# EasyEDA schematic A1-terminal.json
TITLE: APPLE-1 SERIAL TERMINAL; REV: 1.01; Date: 2023-01-21; Sheet: 1/1; Drawn By: CP; Company: P-LAB
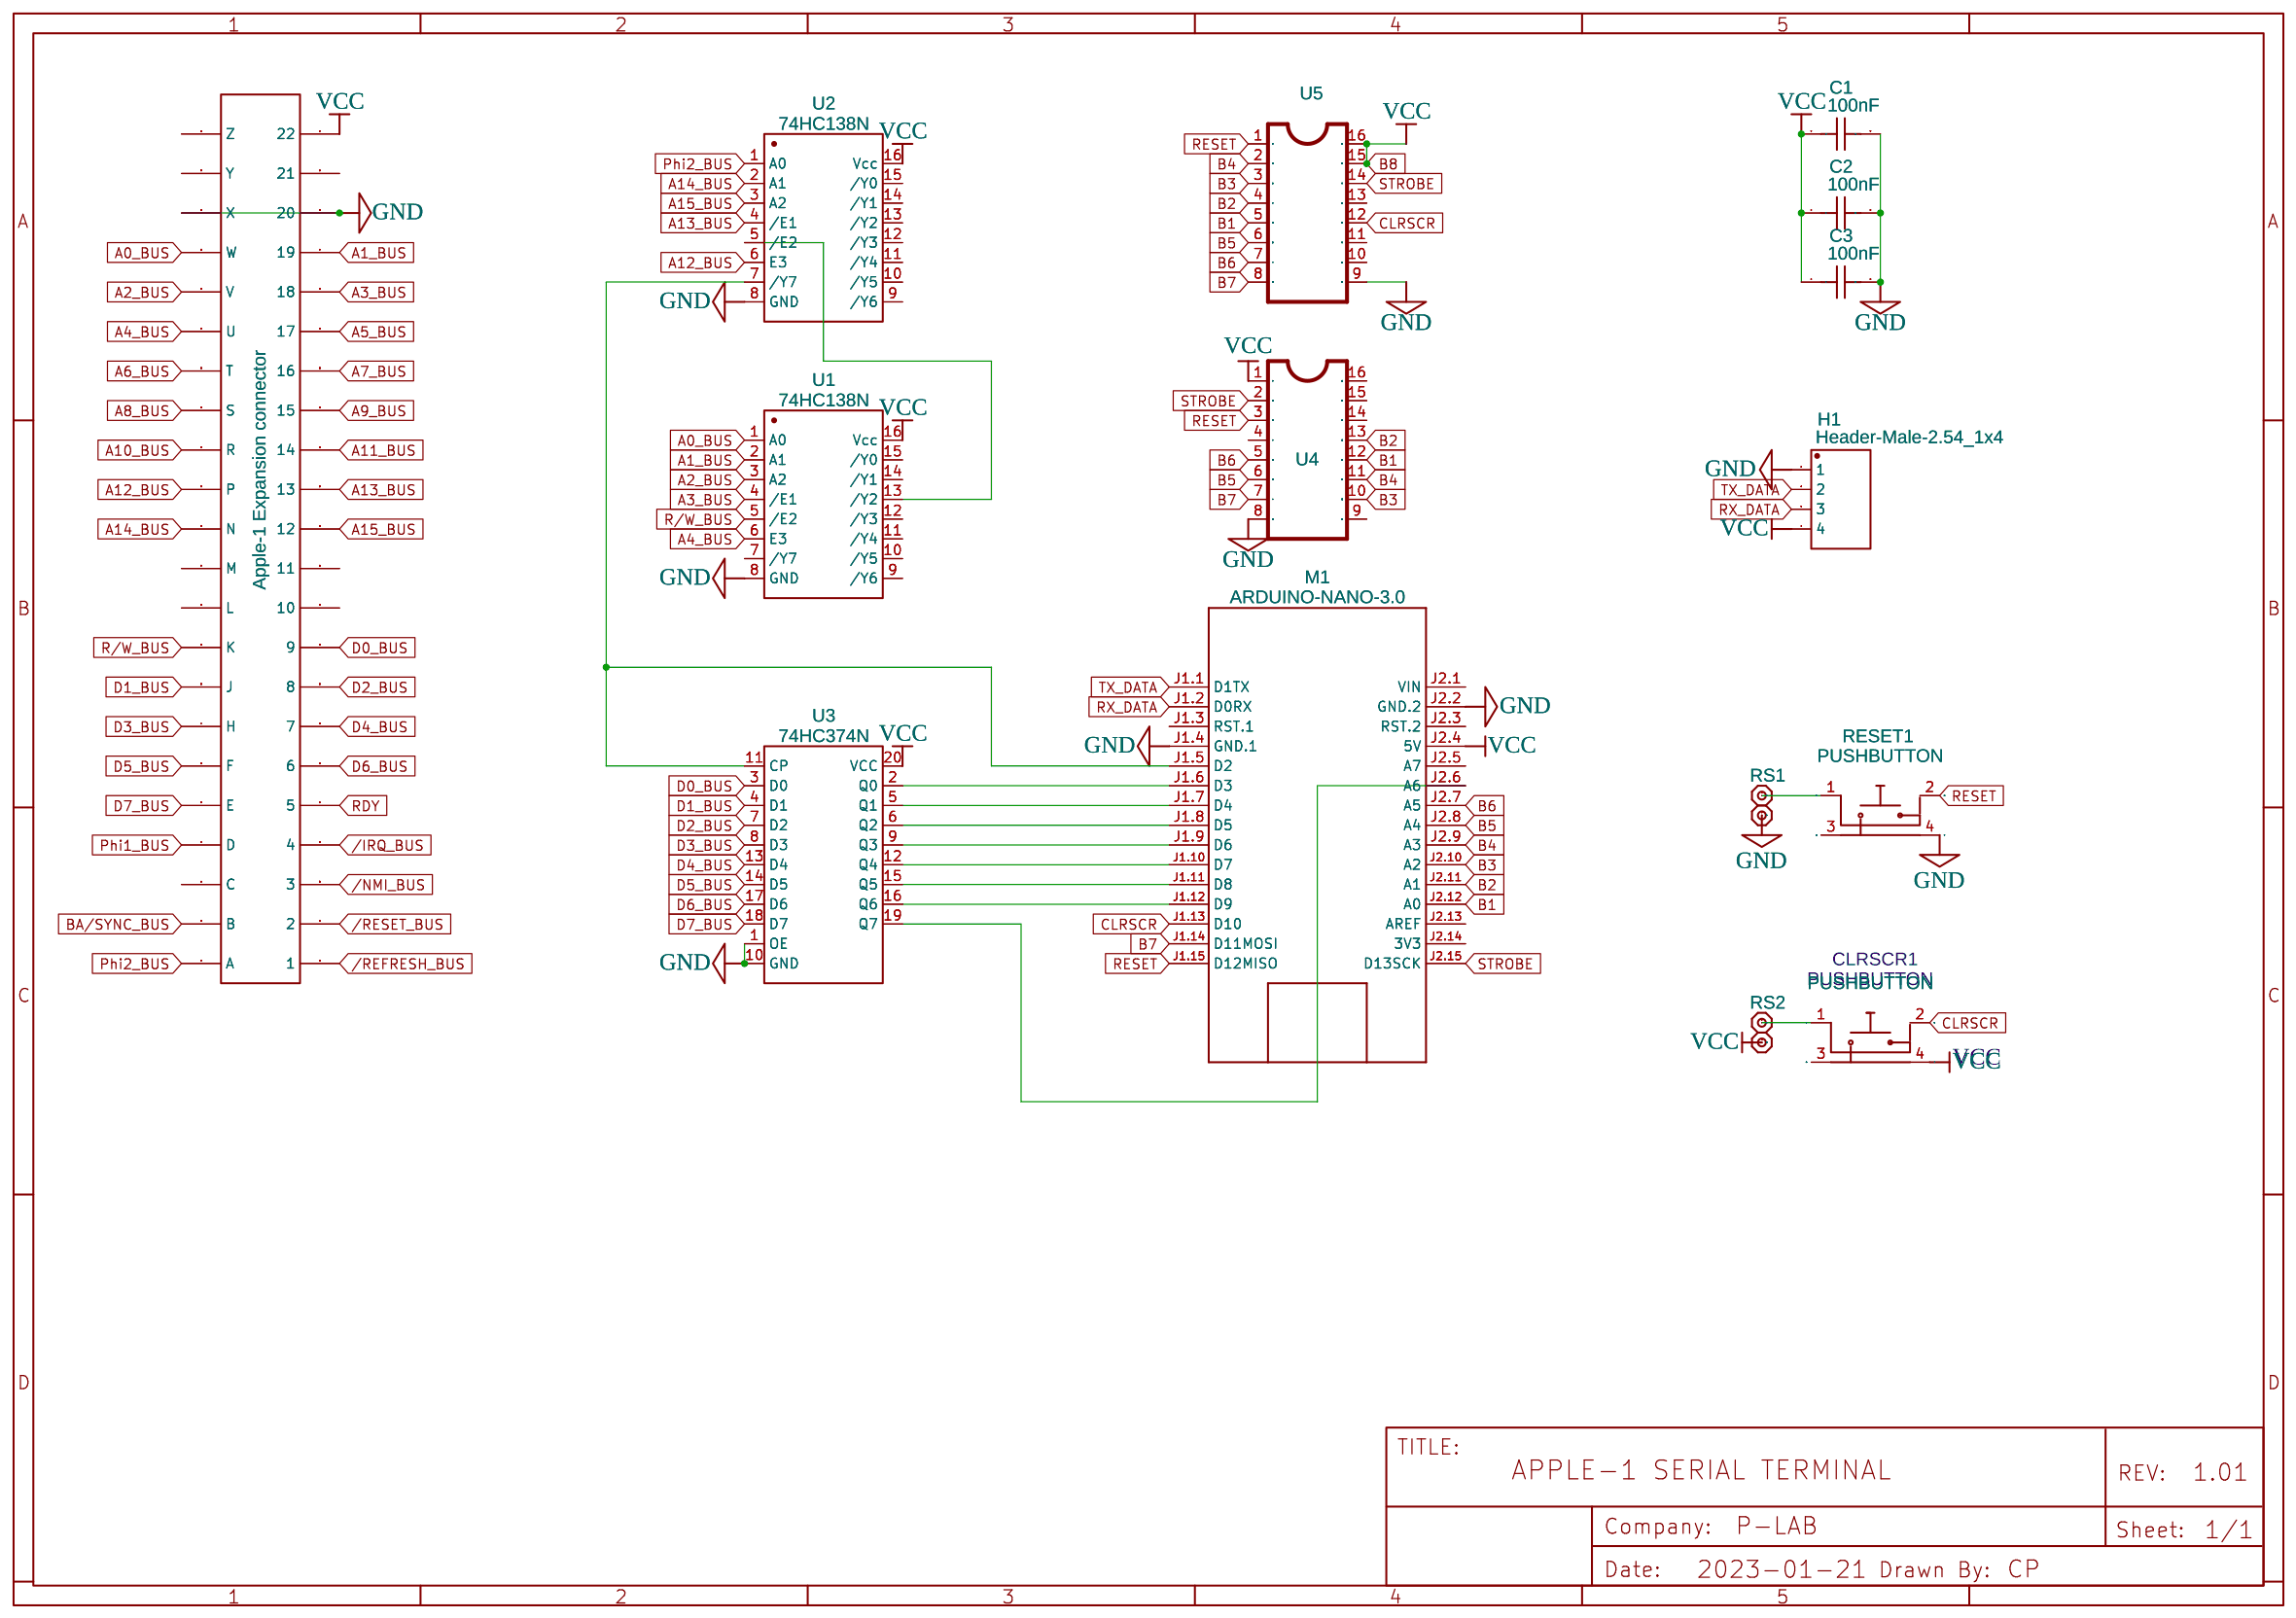
[diagram p0: schematic sheet]

## Parts
C1  100nF  [CAP-TH_L4.8-W3.2-P5.08-D1.2]
C2  100nF  [CAP-TH_L4.8-W3.2-P5.08-D1.2]
C3  100nF  [CAP-TH_L4.8-W3.2-P5.08-D1.2]
CLRSCR2  PUSHBUTTON  [TACTILE-PTH]
H1  Header-Male-2.54_1x4  [HEADER-MALE-2.54_1X4-GEO]
J1  Apple-1 Expansion connector  [EDAC_CARD_EDGE_2X22_PIN_3.96]
M1  ARDUINO-NANO-3.0  [ARDUINO-NANO-3.0]
RESET1  PUSHBUTTON  [TACTILE-PTH]
RS1  Header_Pass_Through_1x2  [HEADER_MALE_1X2]
RS2  Header_Pass_Through_1x2  [HEADER_MALE_1X2]
U1  74HC138N  [DIP16]
U2  74HC138N  [DIP16]
U3  74HC374N  [DIP20-BARRA]
U4  IC_DIL16-DIP16  [DIP16]
U5  IC_DIL16-DIP16  [DIP16]

## Library data of the parts
C1-C3 = CT4G-0805-2X1-50V-0.1UF-K: Supplier: LCSC; Supplier Part: C141981; Manufacturer: TORCH; Manufacturer Part: CT4G-0805-2X1-50V-0.1uF-K; Contributor: LCSC
CLRSCR2 RESET1 = PUSHBUTTON: sourceId: W2ysK2Wdv
H1 = Header-Male-2.54_1x4: Supplier: LCSC; Manufacturer: Ckmtw(灿科盟); Manufacturer Part: B-2100S04P-A110; Contributor: LCSC; Supplier Part: C124378; JLCPCB Part Class: Extended Part; Package Display: No
J1 = EDAC_Card_Edge_Female_2x22_pin_3.96mm: Manufacturer Part: 306-018-520-102; Contributor: burek; Package Display: No
M1 = ARDUINO-NANO-3.0: Arduino Nano 3.0; Package Display: No
RS1 RS2 = Header_Pass_Through_1x2: Manufacturer Part: New SchematicLib; Contributor: breezebro; Package Display: No
U1 U2 = 74HC138N: link: http://www.ti.com/lit/ds/symlink/sn74hc138.pdf; Contributor: taylorza; Package Display: No
U3 = 74HC374N: Contributor: Kspnasa (Kspnasa); Package Display: No
U4 U5 = IC_DIL16-DIP16: Universal 16 pins IC; Contributor: DangerousPrototype

## Nets
GND: C1.2 C2.2 C3.2 H1.1 J1.20(X) J1.42(20) M1.J1.4(GND.1) M1.J2.2(GND.2) RESET1.4 RS1.2 U1.8(GND) U2.8(GND) U3.1(OE) U3.10(GND) U4.8 U5.9
/IRQ_BUS: J1.26(4)
/NMI_BUS: J1.25(3)
/REFRESH_BUS: J1.23(1)
/RESET_BUS: J1.24(2)
A0_BUS: J1.19(W) U1.1(A0)
A1_BUS: J1.41(19) U1.2(A1)
A2_BUS: J1.18(V) U1.3(A2)
A3_BUS: J1.40(18) U1.4(/E1)
A4_BUS: J1.17(U) U1.6(E3)
A5_BUS: J1.39(17)
A6_BUS: J1.16(T)
A7_BUS: J1.38(16)
A8_BUS: J1.15(S)
A9_BUS: J1.37(15)
A10_BUS: J1.14(R)
A11_BUS: J1.36(14)
A12_BUS: J1.13(P) U2.6(E3)
A13_BUS: J1.35(13) U2.4(/E1)
A14_BUS: J1.12(N) U2.2(A1)
A15_BUS: J1.34(12) U2.3(A2)
B1: M1.J2.12(A0) U4.12 U5.5
B2: M1.J2.11(A1) U4.13 U5.4
B3: M1.J2.10(A2) U4.10 U5.3
B4: M1.J2.9(A3) U4.11 U5.2
B5: M1.J2.8(A4) U4.6 U5.6
B6: M1.J2.7(A5) U4.5 U5.7
B7: M1.J1.14(D11MOSI) U4.7 U5.8
B8: C1.1 C2.1 C3.1 CLRSCR2.4 H1.4 J1.44(22) M1.J2.4(5V) RS2.2 U1.16(Vcc) U2.16(Vcc) U3.20(VCC) U4.1 U5.15 U5.16
BA/SYNC_BUS: J1.2(B)
CLRSCR: CLRSCR2.2 M1.J1.13(D10) U5.12
D0_BUS: J1.31(9) U3.3(D0)
D1_BUS: J1.8(J) U3.4(D1)
D2_BUS: J1.30(8) U3.7(D2)
D3_BUS: J1.7(H) U3.8(D3)
D4_BUS: J1.29(7) U3.13(D4)
D5_BUS: J1.6(F) U3.14(D5)
D6_BUS: J1.28(6) U3.17(D6)
D7_BUS: J1.5(E) U3.18(D7)
Phi1_BUS: J1.4(D)
Phi2_BUS: J1.1(A) U2.1(A0)
R/W_BUS: J1.9(K) U1.5(/E2)
RDY: J1.27(5)
RESET: M1.J1.15(D12MISO) RESET1.2 U4.3 U5.1
RX_DATA: H1.3 M1.J1.2(D0RX)
STROBE: M1.J2.15(D13SCK) U4.2 U5.14
TX_DATA: H1.2 M1.J1.1(D1TX)
Net-(CLRSCR2-1): CLRSCR2.1 RS2.1
Net-(M1-J1.5): M1.J1.5(D2) U2.7(/Y7) U3.11(CP)
Net-(M1-J1.6): M1.J1.6(D3) U3.2(Q0)
Net-(M1-J1.7): M1.J1.7(D4) U3.5(Q1)
Net-(M1-J1.8): M1.J1.8(D5) U3.6(Q2)
Net-(M1-J1.9): M1.J1.9(D6) U3.9(Q3)
Net-(M1-J1.10): M1.J1.10(D7) U3.12(Q4)
Net-(M1-J1.11): M1.J1.11(D8) U3.15(Q5)
Net-(M1-J1.12): M1.J1.12(D9) U3.16(Q6)
Net-(M1-J2.6): M1.J2.6(A6) U3.19(Q7)
Net-(RESET1-1): RESET1.1 RS1.1
Net-(U1-13): U1.13(/Y2) U2.5(/E2)

Not connected (* = marked no-connect by the designer): CLRSCR2 3; J1 3(C) 10(L) 11(M) 21(Y) 22(Z) 32(10) 33(11) 43(21); M1 J1.3(RST.1) J2.1(VIN) J2.3(RST.2) J2.5(A7) J2.13(AREF) J2.14(3V3); RESET1 3; U1 7(/Y7) 9(/Y6) 10(/Y5) 11(/Y4) 12(/Y3) 14(/Y1) 15(/Y0); U2 9(/Y6) 10(/Y5) 11(/Y4) 12(/Y3) 13(/Y2) 14(/Y1) 15(/Y0); U4 4 9 14 15 16; U5 10 11 13

## Notes on the sheet
- CLRSCR1
- PUSHBUTTON
- VCC
